# Altium schematic sheet LCD_TFT.SchDoc
size A; SheetNumber: 1; SheetTotal: 4
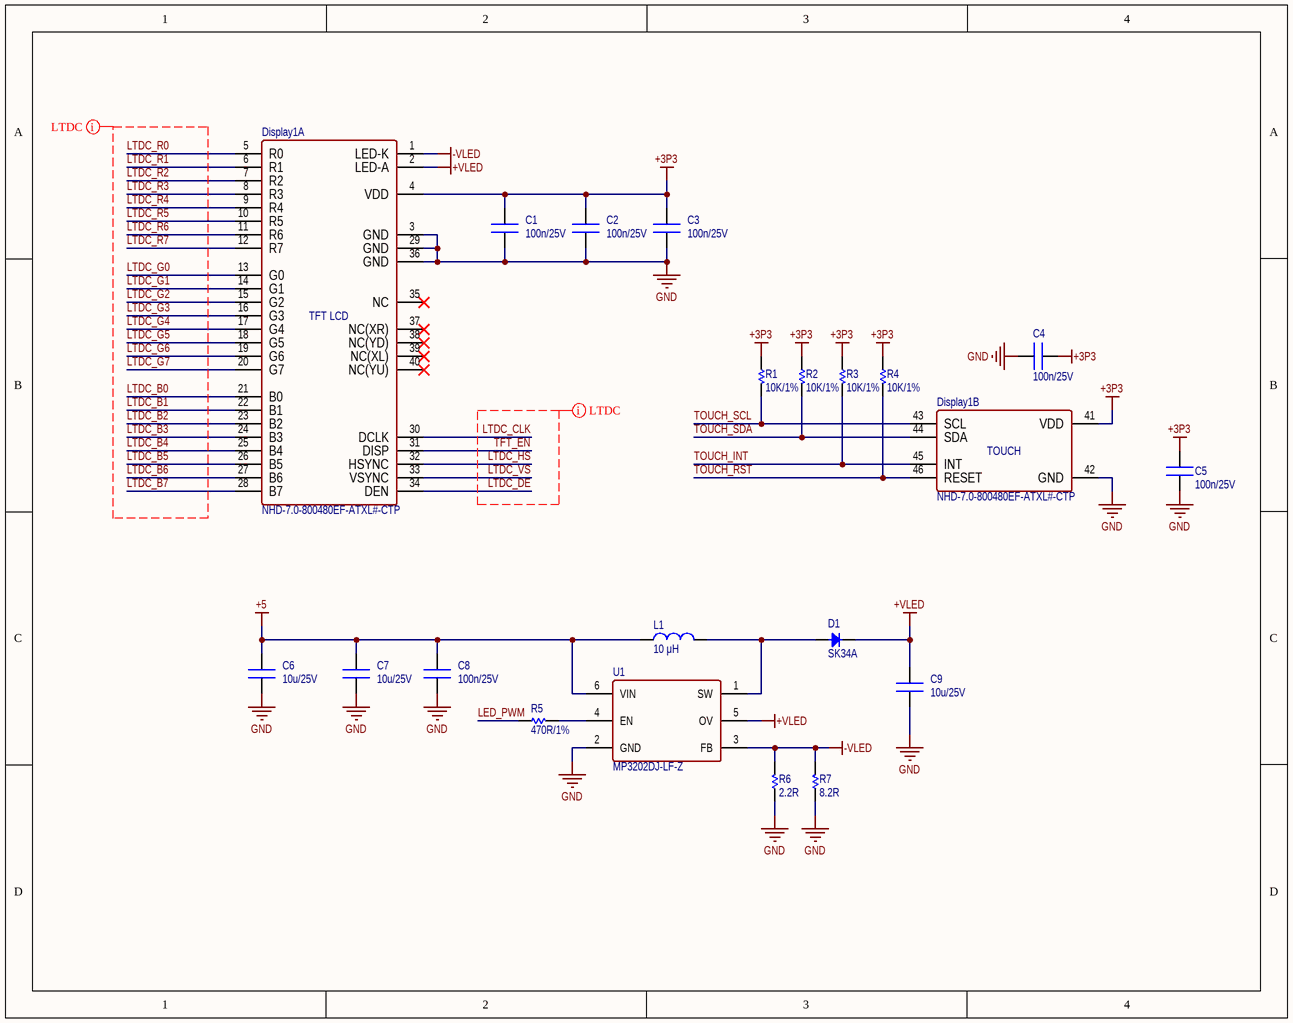
[diagram p0: LCD_TFT.SchDoc]

## Parts
C1  100n/25V  [CN-SMD-0603]
C2  100n/25V  [CN-SMD-0603]
C3  100n/25V  [CN-SMD-0603]
C4  100n/25V  [CN-SMD-0603]
C5  100n/25V  [CN-SMD-0603]
C6  10u/25V  [CN-SMD-0603]
C7  10u/25V  [CN-SMD-0603]
C8  100n/25V  [CN-SMD-0603]
C9  10u/25V  [CN-SMD-0603]
D1  SK34A  [DIO-SMD-A]
Display1  NHD-7.0-800480EF-ATXL#-CTP  [NHD-7.0-800480EF-ATXL#-CTP]  (parts A,B of 2)
L1  10 μH  [L-SMD-M-5x5]
R1  10K/1%  [RES-SMD-0603]
R2  10K/1%  [RES-SMD-0603]
R3  10K/1%  [RES-SMD-0603]
R4  10K/1%  [RES-SMD-0603]
R5  470R/1%  [RES-SMD-0603]
R6  2.2R  [RES-SMD-0805]
R7  8.2R  [RES-SMD-0805]
U1  MP3202DJ-LF-Z  [SOT23-6]

## Nets
+3P3: C1.2 C2.2 C3.2 C4.2 C5.2 Display1.4(VDD) Display1.41(VDD) R1.1 R2.1 R3.1 R4.1
+5: C6.2 C7.2 C8.2 L1.1 U1.6(VIN)
+VLED: C9.2 D1.2(K) Display1.2(LED-A) U1.5(OV)
-VLED: Display1.1(LED-K) R6.2 R7.2 U1.3(FB)
GND: C1.1 C2.1 C3.1 C4.1 C5.1 C6.1 C7.1 C8.1 C9.1 Display1.3(GND) Display1.29(GND) Display1.36(GND) Display1.42(GND) R6.1 R7.1 U1.2(GND)
LED_PWM: R5.1
LTDC_B0: Display1.21(B0)
LTDC_B1: Display1.22(B1)
LTDC_B2: Display1.23(B2)
LTDC_B3: Display1.24(B3)
LTDC_B4: Display1.25(B4)
LTDC_B5: Display1.26(B5)
LTDC_B6: Display1.27(B6)
LTDC_B7: Display1.28(B7)
LTDC_CLK: Display1.30(DCLK)
LTDC_DE: Display1.34(DEN)
LTDC_G0: Display1.13(G0)
LTDC_G1: Display1.14(G1)
LTDC_G2: Display1.15(G2)
LTDC_G3: Display1.16(G3)
LTDC_G4: Display1.17(G4)
LTDC_G5: Display1.18(G5)
LTDC_G6: Display1.19(G6)
LTDC_G7: Display1.20(G7)
LTDC_HS: Display1.32(HSYNC)
LTDC_R0: Display1.5(R0)
LTDC_R1: Display1.6(R1)
LTDC_R2: Display1.7(R2)
LTDC_R3: Display1.8(R3)
LTDC_R4: Display1.9(R4)
LTDC_R5: Display1.10(R5)
LTDC_R6: Display1.11(R6)
LTDC_R7: Display1.12(R7)
LTDC_VS: Display1.33(VSYNC)
TFT_EN: Display1.31(DISP)
TOUCH_INT: Display1.45(INT) R3.2
TOUCH_RST: Display1.46(RESET) R4.2
TOUCH_SCL: Display1.43(SCL) R1.2
TOUCH_SDA: Display1.44(SDA) R2.2
NetD1_1: D1.1(A) L1.2 U1.1(SW)
NetR5_2: R5.2 U1.4(EN)

Not connected (* = marked no-connect by the designer): Display1 35(NC)* 37(NC(XR))* 38(NC(YD))* 39(NC(XL))* 40(NC(YU))*

## Layout directives
net class LTDC: LTDC_B0, LTDC_B1, LTDC_B2, LTDC_B3, LTDC_B4, LTDC_B5, LTDC_B6, LTDC_B7, LTDC_CLK, LTDC_DE, LTDC_G0, LTDC_G1, LTDC_G2, LTDC_G3, LTDC_G4, LTDC_G5, LTDC_G6, LTDC_G7, LTDC_HS, LTDC_R0, LTDC_R1, LTDC_R2, LTDC_R3, LTDC_R4, LTDC_R5, LTDC_R6, LTDC_R7, LTDC_VS, TFT_EN

## Notes on the sheet
- (in symbol NHD-7.0-800480EF-ATXL#-CTP, part A) TFT LCD
- (in symbol NHD-7.0-800480EF-ATXL#-CTP, part B) TOUCH

## Library data of the parts
C1-C5 C8 = CN: CL10B104KA8NNNC; Value: 33pF
C6 C7 C9 = CN: 0603W106M250XD; Value: 33pF
D1 = Diode SMD: Code - JEDEC: DO-214-AB; Published: 8-Jun-2000; Revision: July-2002: Re-released for DXP Platform.; Publisher: Altium Limited; PN: SK34A
Display1 = NHD-7.0-800480EF-ATXL#-CTP: TFT (Thin-Film-Transistor) Color Liquid Crystal Display Module, 0541044031 + 52271-0679; PN: NHD-7.0-800480EF-ATXL#-CTP
L1 = L-SMD-1: NRS5024T100MMGJ; Manufacturer: Wurth Elektronik; PN: NRS5024T100MMGJ; Inductance: 10 μH; ComponentLink1Description: Manufacturer; ComponentLink1URL: http://www.we-online.de; Created by: Baojun Chen; Created Date: Nov.2015; ComponentLink2Description: Datasheet; ComponentLink2URL: http://katalog.we-online.de/pbs/datasheet/78477010.pdf
R1-R4 = Res-SMD: ERJ-3EKF1002V; Manufacturer: Generic Components; Class: Passive; Published: 08/06/2000; Publisher: Altium Hobart Technology Centre
R5 = Res-SMD: ERJ-1GJF4700C; Manufacturer: Generic Components; Class: Passive; Published: 08/06/2000; Publisher: Altium Hobart Technology Centre
R6 = Res-SMD: RMCF0805JT2R20; Manufacturer: Generic Components; Class: Passive; PN: RMCF0805JT2R20; Publisher: Altium Hobart Technology Centre
R7 = Res-SMD: RMCF0805FT8R20; Manufacturer: Generic Components; Class: Passive; PN: RMCF0805FT8R20; Publisher: Altium Hobart Technology Centre
U1 = MP3202: 1.3A Fixed Frequency White LED Driver; PN: MP3202DJ-LF-Z